# Altium schematic sheet S7CAS-PLEIADES-CARTE-MERE_P20_Power-Tree-2.SchDoc
size Tabloid; SheetNumber: 4; SheetTotal: 20; Sheet_Name: Power Tree 2/3; Size: 11x17
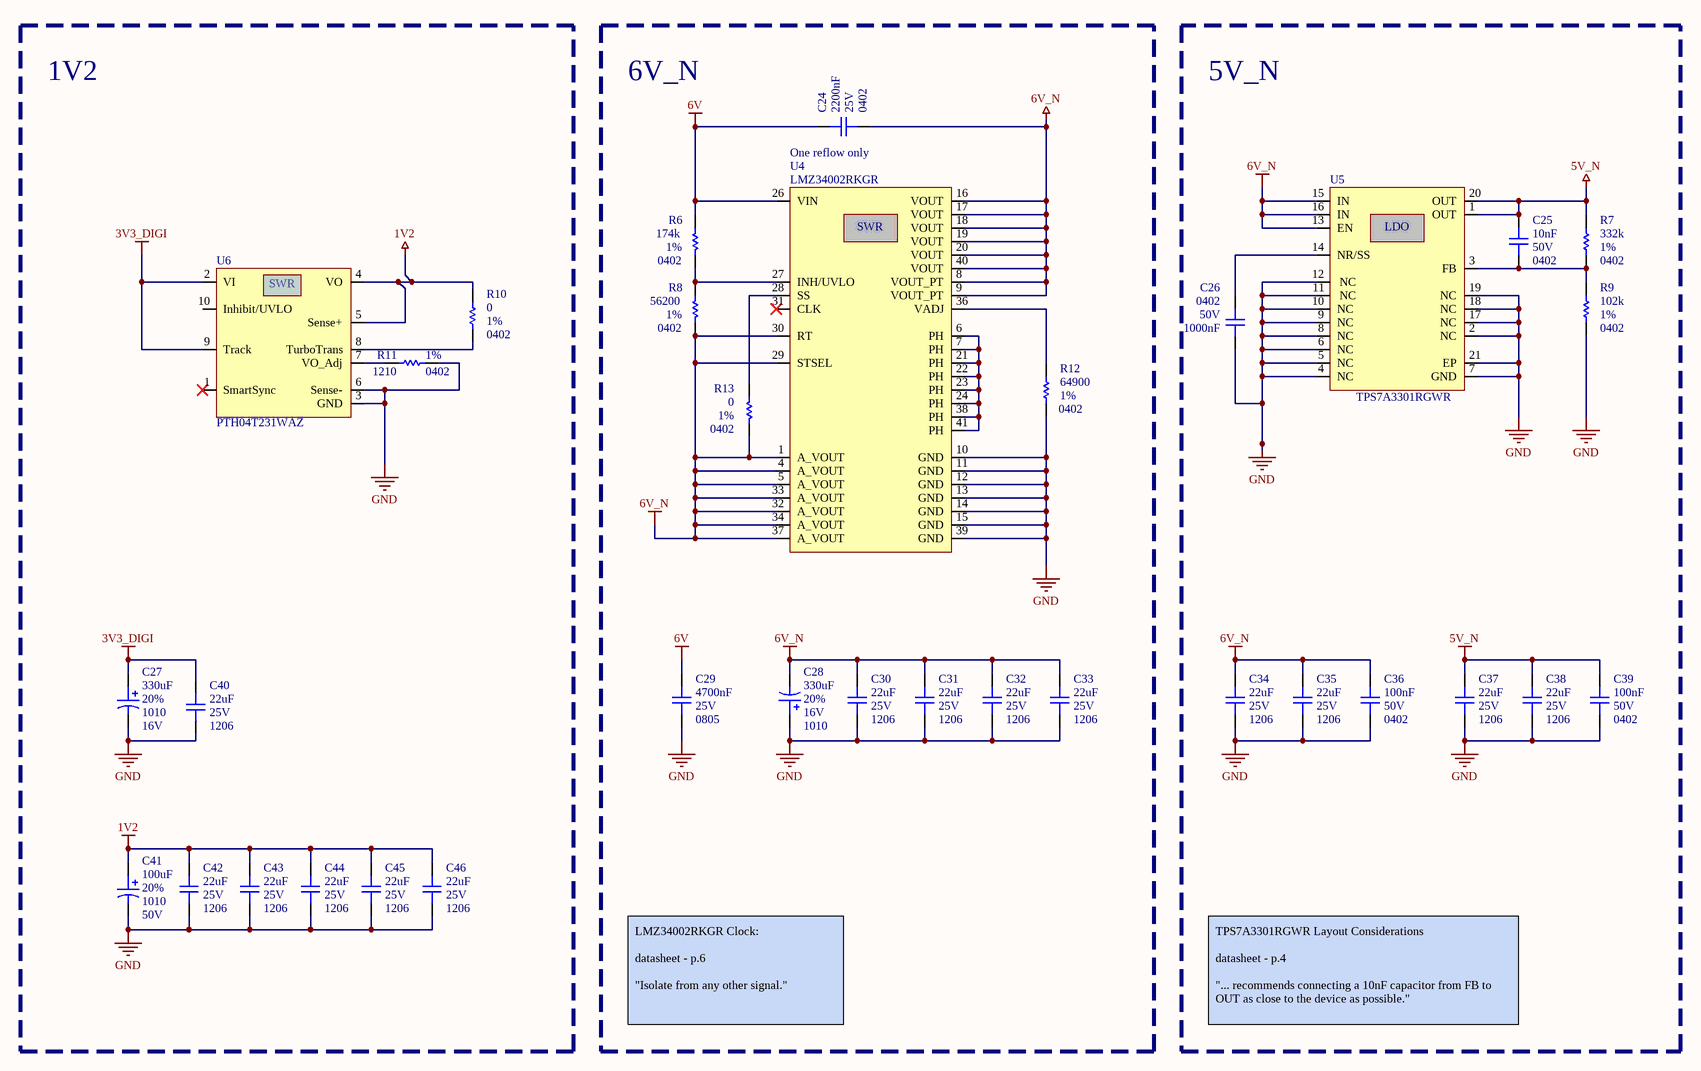
[diagram p0: S7CAS-PLEIADES-CARTE-MERE_P20_Power-Tree-2.SchDoc]

## Parts
C24  value 2200nF  Voltage: 25V  Package: 0402  [CAP_0402]  (hidden comment: CAP - 0402)
C25  value 10nF  Voltage: 50V  Package: 0402  [CAP_0603]  (hidden comment: CAP - 0603)
C26  value 1000nF  Voltage: 50V  Package: 0402  [CAP_0402]  (hidden comment: CAP - 0402)
C27  value 330uF  Voltage: 16V  Package: 1010  Precision: 20%  [CAP_ALU_1010_vishay]  (hidden comment: MAL214699501E3)
C28  value 330uF  Voltage: 16V  Package: 1010  Precision: 20%  [CAP_ALU_1010_vishay]  (hidden comment: MAL214699501E3)
C29  value 4700nF  Voltage: 25V  Package: 0805  [CAP_0805]  (hidden comment: CAP - 0805)
C30  value 22uF  Voltage: 25V  Package: 1206  [CAP_1206]  (hidden comment: CAP - 1206)
C31  value 22uF  Voltage: 25V  Package: 1206  [CAP_1206]  (hidden comment: CAP - 1206)
C32  value 22uF  Voltage: 25V  Package: 1206  [CAP_1206]  (hidden comment: CAP - 1206)
C33  value 22uF  Voltage: 25V  Package: 1206  [CAP_1206]  (hidden comment: CAP - 1206)
C34  value 22uF  Voltage: 25V  Package: 1206  [CAP_1206]  (hidden comment: CAP - 1206)
C35  value 22uF  Voltage: 25V  Package: 1206  [CAP_1206]  (hidden comment: CAP - 1206)
C36  value 100nF  Voltage: 50V  Package: 0402  [CAP_0402]  (hidden comment: CAP - 0402)
C37  value 22uF  Voltage: 25V  Package: 1206  [CAP_1206]  (hidden comment: CAP - 1206)
C38  value 22uF  Voltage: 25V  Package: 1206  [CAP_1206]  (hidden comment: CAP - 1206)
C39  value 100nF  Voltage: 50V  Package: 0402  [CAP_0402]  (hidden comment: CAP - 0402)
C40  value 22uF  Voltage: 25V  Package: 1206  [CAP_1206]  (hidden comment: CAP - 1206)
C41  value 100uF  Voltage: 50V  Package: 1010  Precision: 20%  [CAP_ALU_1010_vishay]  (hidden comment: MAL215099101E3)
C42  value 22uF  Voltage: 25V  Package: 1206  [CAP_1206]  (hidden comment: CAP - 1206)
C43  value 22uF  Voltage: 25V  Package: 1206  [CAP_1206]  (hidden comment: CAP - 1206)
C44  value 22uF  Voltage: 25V  Package: 1206  [CAP_1206]  (hidden comment: CAP - 1206)
C45  value 22uF  Voltage: 25V  Package: 1206  [CAP_1206]  (hidden comment: CAP - 1206)
C46  value 22uF  Voltage: 25V  Package: 1206  [CAP_1206]  (hidden comment: CAP - 1206)
R6  value 174k  Package: 0402  Precision: 1%  [RES_0402]  (hidden comment: RES - 0402)
R7  value 332k  Package: 0402  Precision: 1%  [RES_0402]  (hidden comment: RES - 0402)
R8  value 56200  Package: 0402  Precision: 1%  [RES_0402]  (hidden comment: RES - 0402)
R9  value 102k  Package: 0402  Precision: 1%  [RES_0402]  (hidden comment: RES - 0402)
R10  value 0  Package: 0402  Precision: 1%  [RES_0402]  (hidden comment: RES - 0402)
R11  value 1210  Package: 0402  Precision: 1%  [RES_0402]  (hidden comment: RES - 0402)
R12  value 64900  Package: 0402  Precision: 1%  [RES_0402]  (hidden comment: RES - 0402)
R13  value 0  Package: 0402  Precision: 1%  [RES_0402]  (hidden comment: RES - 0402)
U4  LMZ34002RKGR  Assembly Note: One reflow only  [REG_SWR_LMZ34002RKGR]
U5  TPS7A3301RGWR  [REG_LDO_TPS7A3301RGWR]
U6  PTH04T231WAZ  [REG_SWR_PTH04T231WAZ]

## Blocks framed on the sheet
1V2: C27 C40-C46 R10 R11 U6
6V_N: C24 C28-C33 R6 R8 R12 R13 U4
5V_N: C25 C26 C34-C39 R7 R9 U5

## Nets
1V2: C41.1 C42.2 C43.2 C44.2 C45.2 C46.2 R10.2 U6.4(VO) U6.5(Sense+)
3V3_DIGI: C27.1 C40.2 U6.2(VI) U6.9(Track)
5V_N: C25.2 C37.2 C38.2 C39.2 R7.2 U5.1(OUT) U5.20(OUT)
6V: C24.2 C29.2 R6.2 U4.26(VIN)
6V_N: C24.1 C28.2 C30.2 C31.2 C32.2 C33.2 C34.2 C35.2 C36.2 R8.1 R13.1 U4.1(A_VOUT) U4.4(A_VOUT) U4.5(A_VOUT) U4.8(VOUT_PT) U4.9(VOUT_PT) U4.16(VOUT) U4.17(VOUT) U4.18(VOUT) U4.19(VOUT) U4.20(VOUT) U4.29(STSEL) U4.30(RT) U4.32(A_VOUT) U4.33(A_VOUT) U4.34(A_VOUT) U4.37(A_VOUT) U4.40(VOUT) U5.13(EN) U5.15(IN) U5.16(IN)
GND: C26.1 C27.2 C28.1 C29.1 C30.1 C31.1 C32.1 C33.1 C34.1 C35.1 C36.1 C37.1 C38.1 C39.1 C40.1 C41.2 C42.1 C43.1 C44.1 C45.1 C46.1 R9.1 R11.1 R12.1 U4.10(GND) U4.11(GND) U4.12(GND) U4.13(GND) U4.14(GND) U4.15(GND) U4.39(GND) U5.2(NC) U5.4(NC) U5.5(NC) U5.6(NC) U5.7(GND) U5.8(NC) U5.9(NC) U5.10(NC) U5.11(NC) U5.12(NC) U5.17(NC) U5.18(NC) U5.19(NC) U5.21(EP) U6.3(GND) U6.6(Sense-)
NetC25_1: C25.1 R7.1 R9.2 U5.3(FB)
NetC26_2: C26.2 U5.14(NR/SS)
NetR6_1: R6.1 R8.2 U4.27(INH/UVLO)
NetR10_1: R10.1 U6.8(TurboTrans)
NetR11_2: R11.2 U6.7(VO_Adj)
NetR12_2: R12.2 U4.36(VADJ)
NetR13_2: R13.2 U4.28(SS)
NetU4_6: U4.6(PH) U4.7(PH) U4.21(PH) U4.22(PH) U4.23(PH) U4.24(PH) U4.38(PH) U4.41(PH)

Not connected (* = marked no-connect by the designer): U4 2(DNC) 3(DNC) 25(DNC) 31(CLK)* 35(DNC); U6 1(SmartSync)* 10(Inhibit/UVLO)

## Notes on the sheet
- LMZ34002RKGR Clock:
  datasheet - p.6
  "Isolate from any other signal."
- TPS7A3301RGWR Layout Considerations
  datasheet - p.4
  "... recommends connecting a 10nF capacitor from FB to OUT as close to the device as possible."
- Sheet Name
- Project Title
- Global Project
- Size
- Group
- Revision
- Date
- Sheet
- of
- Filename
- Designers
- (in symbol REG_LDO_TPS7A3301RGWR) LDO
- (in symbol REG_SWR_LMZ34002RKGR) SWR
- (in symbol REG_SWR_PTH04T231WAZ) SWR

## Library data of the parts
C24 = CAP - 0402: Mfg Part Number: GRM155R61E225KE11; Precision: 10%; Current: *; CreatedBy: Jonathan Bouchard; Power: *
C25 = CAP - 0603: Mfg Part Number: GRM155R71H103KA88; Precision: 10%; Current: *; CreatedBy: Jonathan Bouchard; Power: *
C26 = CAP - 0402: Mfg Part Number: GXT155R61E105KE01; Precision: 10%; Current: *; CreatedBy: Jonathan Bouchard; Power: *
C27 C28 = CAP_ALU_MAL214699501E3: CAP - ALU 330uF 20% 16V - 1010; Current: 750mA; Mfg: Vishay Dale; Mfg Part Number: MAL214699501E3; HelpURL: http://www.vishay.com/docs/28403/146cti.pdf; CreatedBy: Jonathan Bouchard; Temperature: -55°C to 125°C; Power: *; Supplier 1: Digikey; Supplier Part Number 1: 4405PHCT-ND
C29 = CAP - 0805: Mfg Part Number: GRM219R61E475KA73; Precision: 10%; Current: *; CreatedBy: Jonathan Bouchard; Power: *
C30-C35 C37 C38 C40 C42-C46 = CAP - 1206: Mfg Part Number: GRM31CC81E226KE11; Precision: 10%; Current: *; HelpURL: https://search.murata.co.jp/Ceramy/image/img/A01X/G101/ENG/GRM31CD71H106KE11-01A.pdf; CreatedBy: Jonathan Bouchard; Power: *
C36 C39 = CAP - 0402: Mfg Part Number: GRM155R61H104KE14; Precision: 10%; Current: *; CreatedBy: Jonathan Bouchard; Power: *
C41 = CAP_ALU_MAL215099101E3: CAP - ALU 100uF 20% 50V - 1010; Current: 490mA; Mfg: Vishay Dale; Mfg Part Number: MAL215099101E3; HelpURL: http://www.vishay.com/docs/28395/150crz.pdf; CreatedBy: Jonathan Bouchard; Temperature: -55°C to 125°C; Power: *; Supplier 1: Digikey; Supplier Part Number 1: 4399PHDKR-ND
R6 = RES - 0402: Mfg Part Number: CRCW0402174KFKEDC; Voltage: 50V; Power: 1/16W; Current: *; CreatedBy: Jonathan Bouchard
R7 = RES - 0402: Mfg Part Number: RK73H1FTTBL3323F; Voltage: 50V; Power: 1/32W; Current: *; CreatedBy: Jonathan Bouchard
R8 = RES - 0402: Voltage: 50V; Mfg: RS73F1ERTTP5622F; Power: 1/8W; Current: *; CreatedBy: Jonathan Bouchard
R9 = RES - 0402: Mfg Part Number: RMCF0402FT102K; Voltage: 50V; Power: 1/16W; Current: *; CreatedBy: Jonathan Bouchard
R10 R13 = RES - 0402: Mfg Part Number: CR200000F; Voltage: 50V; Power: 1/16W; Current: *; CreatedBy: Jonathan Bouchard
R11 = RES - 0402: Mfg Part Number: CRCW04021K21FKEDC; Voltage: 50V; Power: 1/16W; Current: *; CreatedBy: Jonathan Bouchard
R12 = RES - 0402: Mfg Part Number: RMCF0402FT64K9; Voltage: 50V; Power: 1/16W; Current: *; CreatedBy: Jonathan Bouchard
U4 = REG_SWR_LMZ34002RKGR: REG - DC DC Converter -3V to -17V 2A - 41-B1QFN; Manufacturer #1: Texas Instruments; Value: -3 ~ -17V; Voltage Rating: 4.5-40V; Power Max: 15W; GRAMS Lib Spec: 2.8c; Magnetic Material: Unknown; Polarized: Yes; Tolerance: *; Current Rating: 2A; HelpURL: http://www.ti.com/lit/ds/symlink/lmz34002.pdf; CreatedBy/Date: P.Marcoux  20-06-2019; VerifiedBy: C.Paulin - 22/01/2020; Temperature: -40°C ~ 85°C; Package: 41-B1QFN; Manufacturer #2: *; Note: *; Assembly Type: SMD; Part Number #2: *; Part Number #1: LMZ34002RKGR; Supplier 1: Digi-Key; Supplier Part Number 1: 296-44356-1-ND; Cryo: UNKNOWN; Mfg Part Number: LMZ34002RKGR
U5 = REG_LDO_TPS7A3301RGWR: REG - LDO Negative Adjustable 1 Output -1.18V-33V 1A -  20-VQFN (5x5); Manufacturer #1: Texas Instruments; Value: -1.18V~-33V; Voltage Rating: -36V; GRAMS Lib Spec: 2.8; Magnetic Material: Unknown; Polarized: Yes; Tolerance: *; Current Rating: 1A; Power Max: *; HelpURL: http://www.ti.com/lit/ds/symlink/tps7a33.pdf; CreatedBy/Date: Keven Deslandes - 2018/10/11; VerifiedBy: Caroline Paulin - 11/12/2018; Temperature: -40°C ~ 125°C; Package: 20-VQFN; Manufacturer #2: *; Assembly Type: SMD; Part Number #2: *; Part Number #1: TPS7A3301RGWR; Supplier 1: Digi-Key; Supplier Part Number 1: 296-39502-1-ND; Cryo: UNKNOWN; Mfg Part Number: TPS7A3301RGWR
U6 = REG_SWR_PTH04T231WAZ: REG - MODULE PIP 6A 2.2V/5.5V - 10SMD; Manufacturer #1: Texas Instruments; Current Rating: 6A (out); Value: 0.69 - 3.6V (Out); Voltage rating: 2.2-5.5V (Input); Polarized: Yes; Magnetic Material: UNKNOWN; Manufacturer #2: *; Note: *; Power Max: *; Part Number #1: PTH04T231WAZ; Part Number #2: *; HelpURL: http://www.ti.com/lit/ds/symlink/pth04t231w.pdf; Supplier 1: Digi-Key; Assembly Type: SMD; Temperature: -40°C ~ 85°C; Supplier Part Number 1: 296-21792-ND; Package: SMD; CreatedBy/Date: Olivier Bernard / 6/5/2018; VerifiedBy: Caroline Paulin / 10 juillet 2018; Cryo: UNKNOWN; Mfg Part Number: PTH04T231WAZ; Parameter 2: *